# Altium project Button3x4S-2.PrjPCB
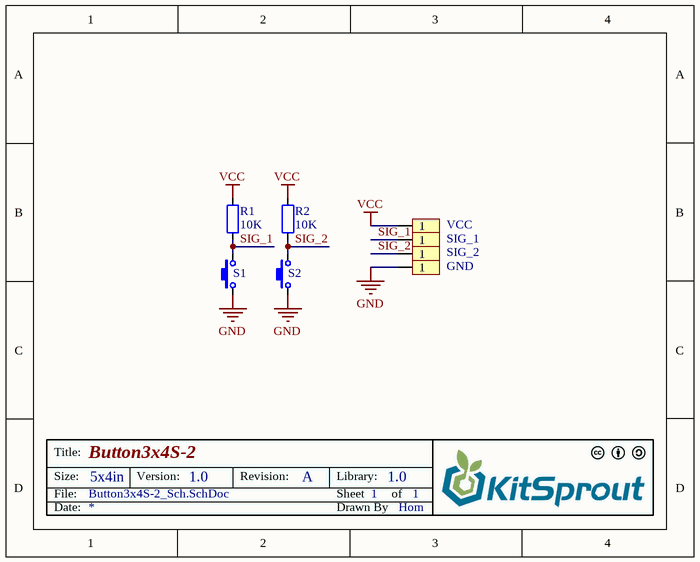
[diagram p0: Button3x4S-2_Sch.SchDoc]
1 sheet, 8 parts. Net scope: global (net labels, ports and power ports of the same name join across sheets).
Board file: Button3x4S-2_Pcb.PcbDoc

## Sheet Button3x4S-2_Sch.SchDoc: Button3x4S-2
size 127 x 101 mm; Author: Hom; CompanyName: KitSprout; DrawnBy: Hom; Engineer: Hom; Organization: KitSprout; Revision: A; SheetNumber: 1; SheetTotal: 1; License: CC BY-SA 4.0; Version: 1.0; LibVersion: 1.0; PageSetup: Record=PageOptions|CenterHorizontal=True|CenterVertical=True|PrintScale=1.00|XCorrection=1.00|YCorrection=1.00|PrintKind=0|BorderSize=5000000|LeftOffset=0|BottomOffset=0|Orientation=2|PaperLength=1000|PaperWidth=1000|Scale=100|PaperSource=7|PrintQuality=-4|MediaType=1|DitherType=10|PaperKind=A4|PrintScaleMode=0

### Parts
GND  HDR-PAD_2.54  [HDR-PAD_2.54]  (value not drawn)
R1  value 10K  [RES_0603]  (hidden comment: Res_0603)
R2  value 10K  [RES_0603]  (hidden comment: Res_0603)
S1  ButtonTACT_3x4x2_180  [ButtonTACT_3x4x2_180H]  (value not drawn)
S2  ButtonTACT_3x4x2_180  [ButtonTACT_3x4x2_180H]  (value not drawn)
SIG_1  HDR-PAD_2.54  [HDR-PAD_2.54]  (value not drawn)
SIG_2  HDR-PAD_2.54  [HDR-PAD_2.54]  (value not drawn)
VCC  HDR-PAD_2.54  [HDR-PAD_2.54]  (value not drawn)

### Nets
GND: GND.1 S1.1 S2.1
VCC: R1.2 R2.2 VCC.1
SIG_1: R1.1 S1.2 SIG_1.1
SIG_2: R2.1 S2.2 SIG_2.1

### Notes on the sheet
- Title:
- Size:
- Date:
- File:
- 5x4in
- Version:
- Revision:
- Sheet
- Drawn By
- Library:
- of

### Library data of the parts
GND SIG_1 SIG_2 VCC = HDR-PAD_2.54: Header
R1 R2 = Res_0603: Resistor
S1 S2 = ButtonTACT_3x4x2_180: Button